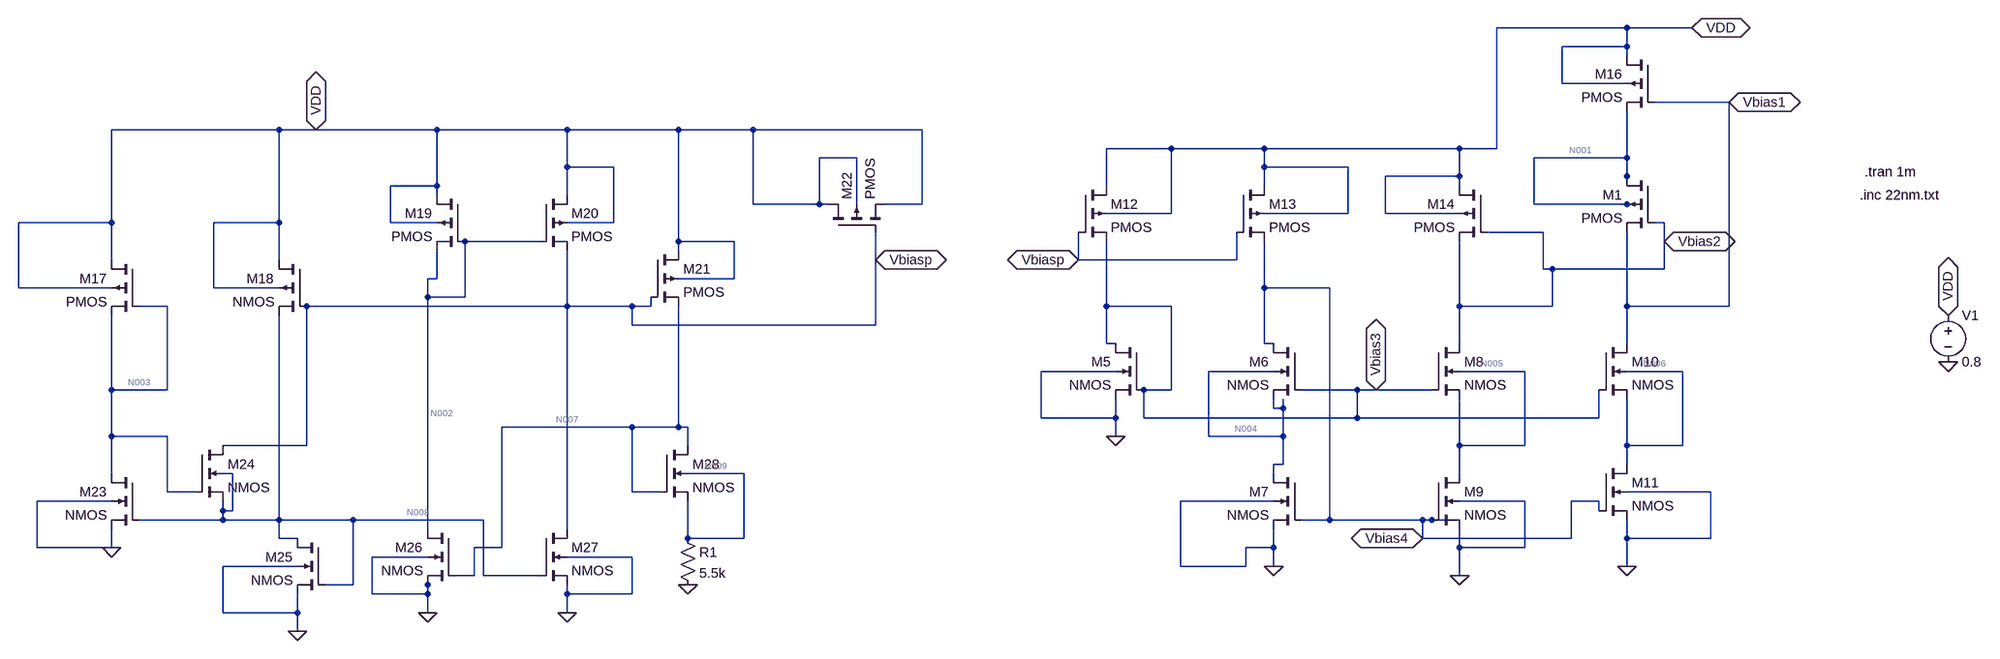
[diagram p0: schematic BetaMultiplier&CurrentMirror.asc]
BetaMultiplier&CurrentMirror.asc, the LTspice schematic file:
Version 4
SHEET 1 1872 1540
WIRE -1600 -416 -1824 -416
WIRE -1488 -416 -1600 -416
WIRE -1600 -384 -1600 -416
WIRE -1600 -384 -1712 -384
WIRE -1600 -368 -1600 -384
WIRE -1712 -320 -1712 -384
WIRE -1600 -320 -1712 -320
WIRE -1424 -288 -1552 -288
WIRE -4432 -240 -4720 -240
WIRE -4368 -240 -4432 -240
WIRE -4160 -240 -4368 -240
WIRE -3936 -240 -4160 -240
WIRE -3744 -240 -3936 -240
WIRE -3616 -240 -3744 -240
WIRE -3312 -240 -3616 -240
WIRE -2384 -208 -2496 -208
WIRE -2224 -208 -2384 -208
WIRE -1888 -208 -2224 -208
WIRE -1824 -208 -1824 -416
WIRE -1824 -208 -1888 -208
WIRE -3424 -192 -3488 -192
WIRE -1600 -192 -1600 -272
WIRE -1600 -192 -1760 -192
WIRE -3936 -176 -3936 -240
WIRE -3856 -176 -3936 -176
WIRE -2224 -176 -2224 -208
WIRE -2080 -176 -2224 -176
WIRE -1888 -160 -1888 -208
WIRE -1888 -160 -2016 -160
WIRE -1600 -160 -1600 -192
WIRE -4160 -144 -4160 -240
WIRE -4160 -144 -4240 -144
WIRE -2496 -144 -2496 -208
WIRE -2224 -144 -2224 -176
WIRE -1888 -144 -1888 -160
WIRE -1600 -144 -1600 -160
WIRE -4160 -128 -4160 -144
WIRE -3936 -128 -3936 -176
WIRE -3616 -112 -3616 -240
WIRE -3488 -112 -3488 -192
WIRE -3488 -112 -3616 -112
WIRE -3472 -112 -3488 -112
WIRE -3424 -112 -3424 -192
WIRE -3312 -112 -3312 -240
WIRE -3312 -112 -3376 -112
WIRE -1760 -112 -1760 -192
WIRE -1600 -112 -1760 -112
WIRE -1584 -112 -1600 -112
WIRE -2384 -96 -2384 -208
WIRE -2384 -96 -2496 -96
WIRE -2080 -96 -2080 -176
WIRE -2080 -96 -2224 -96
WIRE -2016 -96 -2016 -160
WIRE -1888 -96 -2016 -96
WIRE -4720 -80 -4720 -240
WIRE -4720 -80 -4880 -80
WIRE -4432 -80 -4432 -240
WIRE -4432 -80 -4544 -80
WIRE -4240 -80 -4240 -144
WIRE -4160 -80 -4240 -80
WIRE -3856 -80 -3856 -176
WIRE -3856 -80 -3936 -80
WIRE -1536 -80 -1552 -80
WIRE -1744 -64 -1840 -64
WIRE -3984 -48 -4112 -48
WIRE -3744 -48 -3744 -240
WIRE -3648 -48 -3744 -48
WIRE -1536 -48 -1536 -80
WIRE -3744 -32 -3744 -48
WIRE -4720 -16 -4720 -80
WIRE -4432 -16 -4432 -80
WIRE -3392 -16 -3392 -64
WIRE -2544 -16 -2544 -64
WIRE -2272 -16 -2272 -64
WIRE -2272 -16 -2544 -16
WIRE -1744 0 -1744 -64
WIRE -1728 0 -1744 0
WIRE -1536 0 -1536 -48
WIRE -1536 0 -1728 0
WIRE -4160 16 -4160 -32
WIRE -4160 16 -4176 16
WIRE -3648 16 -3648 -48
WIRE -3648 16 -3744 16
WIRE -4880 32 -4880 -80
WIRE -4720 32 -4880 32
WIRE -4544 32 -4544 -80
WIRE -4432 32 -4544 32
WIRE -2224 32 -2224 -48
WIRE -2112 32 -2224 32
WIRE -4176 48 -4176 16
WIRE -4112 48 -4112 -48
WIRE -4112 48 -4176 48
WIRE -4624 64 -4672 64
WIRE -3936 64 -3936 -32
WIRE -3936 64 -4384 64
WIRE -3824 64 -3936 64
WIRE -3792 64 -3792 48
WIRE -3792 64 -3824 64
WIRE -2496 64 -2496 -48
WIRE -2384 64 -2496 64
WIRE -1888 64 -1888 -48
WIRE -1728 64 -1728 0
WIRE -1728 64 -1888 64
WIRE -1600 64 -1600 -64
WIRE -1424 64 -1424 -288
WIRE -1424 64 -1600 64
WIRE -3824 96 -3824 64
WIRE -3392 96 -3392 -16
WIRE -3392 96 -3824 96
WIRE -2496 128 -2496 64
WIRE -2480 128 -2496 128
WIRE -2224 128 -2224 32
WIRE -2208 128 -2224 128
WIRE -1888 128 -1888 64
WIRE -1600 128 -1600 64
WIRE -2480 176 -2608 176
WIRE -2208 176 -2320 176
WIRE -1776 176 -1888 176
WIRE -1504 176 -1600 176
WIRE -4720 208 -4720 80
WIRE -4624 208 -4624 64
WIRE -4624 208 -4720 208
WIRE -2384 208 -2384 64
WIRE -2384 208 -2432 208
WIRE -2064 208 -2160 208
WIRE -2032 208 -2064 208
WIRE -1936 208 -2032 208
WIRE -2208 240 -2208 224
WIRE -2192 240 -2192 224
WIRE -2192 240 -2208 240
WIRE -2608 256 -2608 176
WIRE -2480 256 -2480 224
WIRE -2480 256 -2608 256
WIRE -2432 256 -2432 208
WIRE -2064 256 -2064 208
WIRE -2064 256 -2432 256
WIRE -1648 256 -1648 208
WIRE -1648 256 -2064 256
WIRE -3824 272 -4048 272
WIRE -3744 272 -3744 64
WIRE -3744 272 -3824 272
WIRE -3728 272 -3744 272
WIRE -4720 288 -4720 208
WIRE -4624 288 -4720 288
WIRE -2480 288 -2480 256
WIRE -2320 288 -2320 176
WIRE -2192 288 -2192 240
WIRE -2192 288 -2320 288
WIRE -4384 304 -4384 64
WIRE -4384 304 -4528 304
WIRE -3728 304 -3728 272
WIRE -1888 304 -1888 224
WIRE -1776 304 -1776 176
WIRE -1776 304 -1888 304
WIRE -1600 304 -1600 224
WIRE -1504 304 -1504 176
WIRE -1504 304 -1600 304
WIRE -2192 336 -2192 288
WIRE -2192 336 -2208 336
WIRE -1600 336 -1600 304
WIRE -4720 352 -4720 288
WIRE -4512 352 -4528 352
WIRE -3632 352 -3728 352
WIRE -2208 352 -2208 336
WIRE -1888 352 -1888 304
WIRE -4624 384 -4624 288
WIRE -4576 384 -4624 384
WIRE -3824 384 -3824 272
WIRE -3776 384 -3824 384
WIRE -1456 384 -1600 384
WIRE -4720 400 -4848 400
WIRE -2208 400 -2368 400
WIRE -1776 400 -1888 400
WIRE -1648 400 -1696 400
WIRE -4528 416 -4528 400
WIRE -4512 416 -4512 352
WIRE -4512 416 -4528 416
WIRE -1648 416 -1648 400
WIRE -4528 432 -4528 416
WIRE -4528 432 -4672 432
WIRE -4432 432 -4432 80
WIRE -4432 432 -4528 432
WIRE -4304 432 -4432 432
WIRE -4080 432 -4304 432
WIRE -2112 432 -2112 32
WIRE -2112 432 -2160 432
WIRE -1952 432 -2112 432
WIRE -1936 432 -1952 432
WIRE -1904 432 -1936 432
WIRE -4176 448 -4176 48
WIRE -3936 448 -3936 64
WIRE -4432 464 -4432 432
WIRE -4400 464 -4432 464
WIRE -3728 464 -3728 400
WIRE -3632 464 -3632 352
WIRE -3632 464 -3728 464
WIRE -1952 464 -1952 432
WIRE -1696 464 -1696 400
WIRE -1696 464 -1952 464
WIRE -1600 464 -1600 432
WIRE -1456 464 -1456 384
WIRE -1456 464 -1600 464
WIRE -4848 480 -4848 400
WIRE -4720 480 -4720 448
WIRE -4720 480 -4848 480
WIRE -4048 480 -4048 272
WIRE -4048 480 -4096 480
WIRE -2208 480 -2208 448
WIRE -2208 480 -2256 480
WIRE -1888 480 -1888 448
WIRE -1776 480 -1776 400
WIRE -1776 480 -1888 480
WIRE -4176 496 -4272 496
WIRE -3824 496 -3936 496
WIRE -4400 512 -4528 512
WIRE -2368 512 -2368 400
WIRE -2256 512 -2256 480
WIRE -2256 512 -2368 512
WIRE -2208 512 -2208 480
WIRE -1600 512 -1600 464
WIRE -4096 528 -4096 480
WIRE -4096 528 -4128 528
WIRE -4080 528 -4080 432
WIRE -3984 528 -4080 528
WIRE -1888 528 -1888 480
WIRE -4304 544 -4304 432
WIRE -4304 544 -4352 544
WIRE -4176 544 -4176 528
WIRE -4272 560 -4272 496
WIRE -4176 560 -4176 544
WIRE -4176 560 -4272 560
WIRE -3936 560 -3936 544
WIRE -3824 560 -3824 496
WIRE -3824 560 -3936 560
WIRE -4528 592 -4528 512
WIRE -4400 592 -4400 560
WIRE -4400 592 -4528 592
WIRE -4176 592 -4176 560
WIRE -3936 592 -3936 560
WIRE -4400 624 -4400 592
FLAG -752 160 0
FLAG -752 80 VDD
IOPIN -752 80 BiDir
FLAG -2480 288 0
FLAG -2208 512 0
FLAG -1888 528 0
FLAG -1600 512 0
FLAG -1488 -416 VDD
IOPIN -1488 -416 BiDir
FLAG -1424 -288 Vbias1
IOPIN -1424 -288 BiDir
FLAG -1536 -48 Vbias2
IOPIN -1536 -48 BiDir
FLAG -2032 208 Vbias3
IOPIN -2032 208 BiDir
FLAG -1952 464 Vbias4
IOPIN -1952 464 BiDir
FLAG -2544 -16 Vbiasp
IOPIN -2544 -16 BiDir
FLAG -4720 480 0
FLAG -4400 624 0
FLAG -4176 592 0
FLAG -3936 592 0
FLAG -3728 544 0
FLAG -4368 -240 VDD
IOPIN -4368 -240 BiDir
FLAG -3392 -16 Vbiasp
IOPIN -3392 -16 BiDir
SYMBOL voltage -752 64 R0
WINDOW 123 0 0 Left 0
WINDOW 39 0 0 Left 0
SYMATTR InstName V1
SYMATTR Value 0.8
SYMBOL nmos4 -2432 128 M0
SYMATTR InstName M5
SYMATTR Value2 l=990n w=22n
SYMBOL nmos4 -2160 128 M0
SYMATTR InstName M6
SYMATTR Value2 l=44n w=540n
SYMBOL nmos4 -2160 352 M0
SYMATTR InstName M7
SYMATTR Value2 l=44n w=270n
SYMBOL nmos4 -1936 128 R0
SYMATTR InstName M8
SYMATTR Value2 l=44n w=55n
SYMBOL nmos4 -1936 352 R0
SYMATTR InstName M9
SYMATTR Value2 l=44n w=660n
SYMBOL nmos4 -1648 128 R0
SYMATTR InstName M10
SYMATTR Value2 l=22n w=88n
SYMBOL nmos4 -1648 336 R0
SYMATTR InstName M11
SYMATTR Value2 l=44n w=1503.25n
SYMBOL pmos4 -2544 -144 R0
SYMATTR InstName M12
SYMATTR Value2 l=22n w=778n
SYMBOL pmos4 -2272 -144 R0
SYMATTR InstName M13
SYMATTR Value2 l=44n w=440n
SYMBOL pmos4 -1840 -144 M0
SYMATTR InstName M14
SYMATTR Value2 l=536.41n w=44n
SYMBOL pmos4 -1552 -368 M0
SYMATTR InstName M16
SYMATTR Value2 l=44n w=58.0856n
SYMBOL pmos4 -4672 -16 M0
SYMATTR InstName M17
SYMATTR Value2 l=44n w=22n
SYMBOL pmos4 -4384 -16 M0
SYMATTR InstName M18
SYMATTR Value NMOS
SYMATTR Value2 l=22n w=264n
SYMBOL pmos4 -4112 -128 M0
SYMATTR InstName M19
SYMATTR Value2 l=22n w=264n
SYMBOL pmos4 -3984 -128 R0
SYMATTR InstName M20
SYMATTR Value2 l=22n w=264n
SYMBOL pmos4 -3792 -32 R0
SYMATTR InstName M21
SYMATTR Value2 l=22n w=264n
SYMBOL pmos4 -3472 -64 R270
SYMATTR InstName M22
SYMATTR Value2 l=22n w=22n
SYMBOL nmos4 -4672 352 M0
SYMATTR InstName M23
SYMATTR Value2 l=22n w=110n
SYMBOL nmos4 -4576 304 R0
SYMATTR InstName M24
SYMATTR Value2 l=22n w=44n
SYMBOL nmos4 -4352 464 M0
SYMATTR InstName M25
SYMATTR Value2 l=22n w=110n
SYMBOL nmos4 -4128 448 M0
SYMATTR InstName M26
SYMATTR Value2 l=22n w=110n
SYMBOL nmos4 -3984 448 R0
SYMATTR InstName M27
SYMATTR Value2 l=22n w=110n
SYMBOL nmos4 -3776 304 R0
SYMATTR InstName M28
SYMATTR Value2 l=22n w=110n
SYMBOL res -3744 448 R0
SYMATTR InstName R1
SYMATTR Value 5.5k
SYMBOL pmos4 -1552 -160 M0
SYMATTR InstName M1
SYMATTR Value2 l=22n w=44n
TEXT -904 -128 Left 2 !.inc 22nm.txt
TEXT -896 -168 Left 2 !.tran 1m

The netlist it stands for:
* BetaMultiplier&CurrentMirror.asc
V1 VDD 0 0.8
M5 Vbias3 Vbias3 0 0 NMOS l=990n w=22n
M6 Vbias4 Vbias3 N004 N004 NMOS l=44n w=540n
M7 N004 Vbias4 0 0 NMOS l=44n w=270n
M8 Vbias2 Vbias3 N005 N005 NMOS l=44n w=55n
M9 N005 Vbias4 0 0 NMOS l=44n w=660n
M10 Vbias1 Vbias3 N006 N006 NMOS l=22n w=88n
M11 N006 Vbias4 0 0 NMOS l=44n w=1503.25n
M12 VDD Vbiasp Vbias3 VDD PMOS l=22n w=778n
M13 VDD Vbiasp Vbias4 VDD PMOS l=44n w=440n
M14 VDD Vbias2 Vbias2 VDD PMOS l=536.41n w=44n
M16 VDD Vbias1 N001 VDD PMOS l=44n w=58.0856n
M17 VDD N003 N003 VDD PMOS l=44n w=22n
M18 VDD Vbiasp N008 VDD NMOS l=22n w=264n
M19 VDD N002 N002 VDD PMOS l=22n w=264n
M20 VDD N002 Vbiasp VDD PMOS l=22n w=264n
M21 VDD Vbiasp N007 VDD PMOS l=22n w=264n
M22 VDD Vbiasp VDD VDD PMOS l=22n w=22n
M23 N003 N008 0 0 NMOS l=22n w=110n
M24 Vbiasp N003 N008 N008 NMOS l=22n w=44n
M25 N008 N008 0 0 NMOS l=22n w=110n
M26 N002 N007 0 0 NMOS l=22n w=110n
M27 Vbiasp N008 0 0 NMOS l=22n w=110n
M28 N007 N007 N009 N009 NMOS l=22n w=110n
R1 N009 0 5.5k
M1 N001 Vbias2 Vbias1 N001 PMOS l=22n w=44n
.model NMOS NMOS
.model PMOS PMOS
.lib standard.mos
.inc 22nm.txt
.tran 1m
.backanno
.end

* Results of the author's LTspice run, read from the files saved beside the schematic
* Operating Point, zero values left out:
*   V(vdd) = 800 mV
*   V(vbias3) = 785 mV
*   V(vbias4) = 295.2 mV
*   V(n004) = 294.9 mV
*   V(vbias2) = 100 mV
*   V(n005) = 98.14 mV
*   V(vbias1) = 300 mV
*   V(n006) = 296.3 mV
*   V(vbiasp) = 489 mV
*   V(n001) = 485.1 mV
*   V(n003) = 165.6 mV
*   V(n008) = 340.6 mV
*   V(n002) = 436.4 mV
*   V(n007) = 370.8 mV
*   V(n009) = 16.06 mV
*   Id(M5) = 249.7 nA
*   Ig(M5) = 228.9 pA
*   Ib(M5) = -7.839 pA
*   Is(M5) = -249.9 nA
*   Id(M6) = 71.88 nA
*   Ig(M6) = 22.82 pA
*   Is(M6) = -71.9 nA
*   Id(M7) = 71.9 nA
*   Is(M7) = -71.9 nA
*   Id(M8) = 157.7 nA
*   Ig(M8) = 18.95 pA
*   Is(M8) = -157.7 nA
*   Id(M9) = 157.7 nA
*   Ig(M9) = 2.039 pA
*   Is(M9) = -157.7 nA
*   Id(M10) = 413.3 nA
*   Ig(M10) = 2.692 pA
*   Is(M10) = -413.3 nA
*   Id(M11) = 413.3 nA
*   Ig(M11) = 4.049 pA
*   Is(M11) = -413.3 nA
*   Id(M18) = 2.087 µA
*   Ig(M18) = -4.898 pA
*   Ib(M18) = 1.502 nA
*   Is(M18) = -2.088 µA
*   Id(M23) = 841.3 nA
*   Is(M23) = -841.3 nA
*   Id(M24) = 1.554 pA
*   Id(M25) = 2.088 µA
*   Is(M25) = -2.088 µA
*   Id(M26) = 5.581 µA
*   Is(M26) = -5.581 µA
*   Id(M27) = 4.192 µA
*   Is(M27) = -4.192 µA
*   Id(M28) = 2.92 µA
*   Is(M28) = -2.92 µA
*   Id(M12) = 250 nA
*   Is(M12) = -250 nA
*   Id(M13) = 71.88 nA
*   Is(M13) = -71.88 nA
*   Id(M14) = 157.7 nA
*   Ig(M14) = -2.362 pA
*   Ib(M14) = 3.055 pA
*   Is(M14) = -157.7 nA
*   Id(M16) = 413.3 nA
*   Is(M16) = -413.3 nA
*   Id(M17) = 841.3 nA
*   Is(M17) = -841.3 nA
*   Id(M19) = 5.581 µA
*   Is(M19) = -5.581 µA
*   Id(M20) = 4.192 µA
*   Is(M20) = -4.192 µA
*   Id(M21) = 2.92 µA
*   Is(M21) = -2.92 µA
*   Id(M1) = 413.3 nA
*   Is(M1) = -413.3 nA
*   I(R1) = 2.92 µA
*   I(V1) = -16.52 µA